# EAGLE design STK-681-332-E EvalBoard OwnRoutingStarted V4.2 (EAGLE 9.3.1)

## Sheet 1 of 3: Supply, Reverse Voltage Protection, Power Indicators
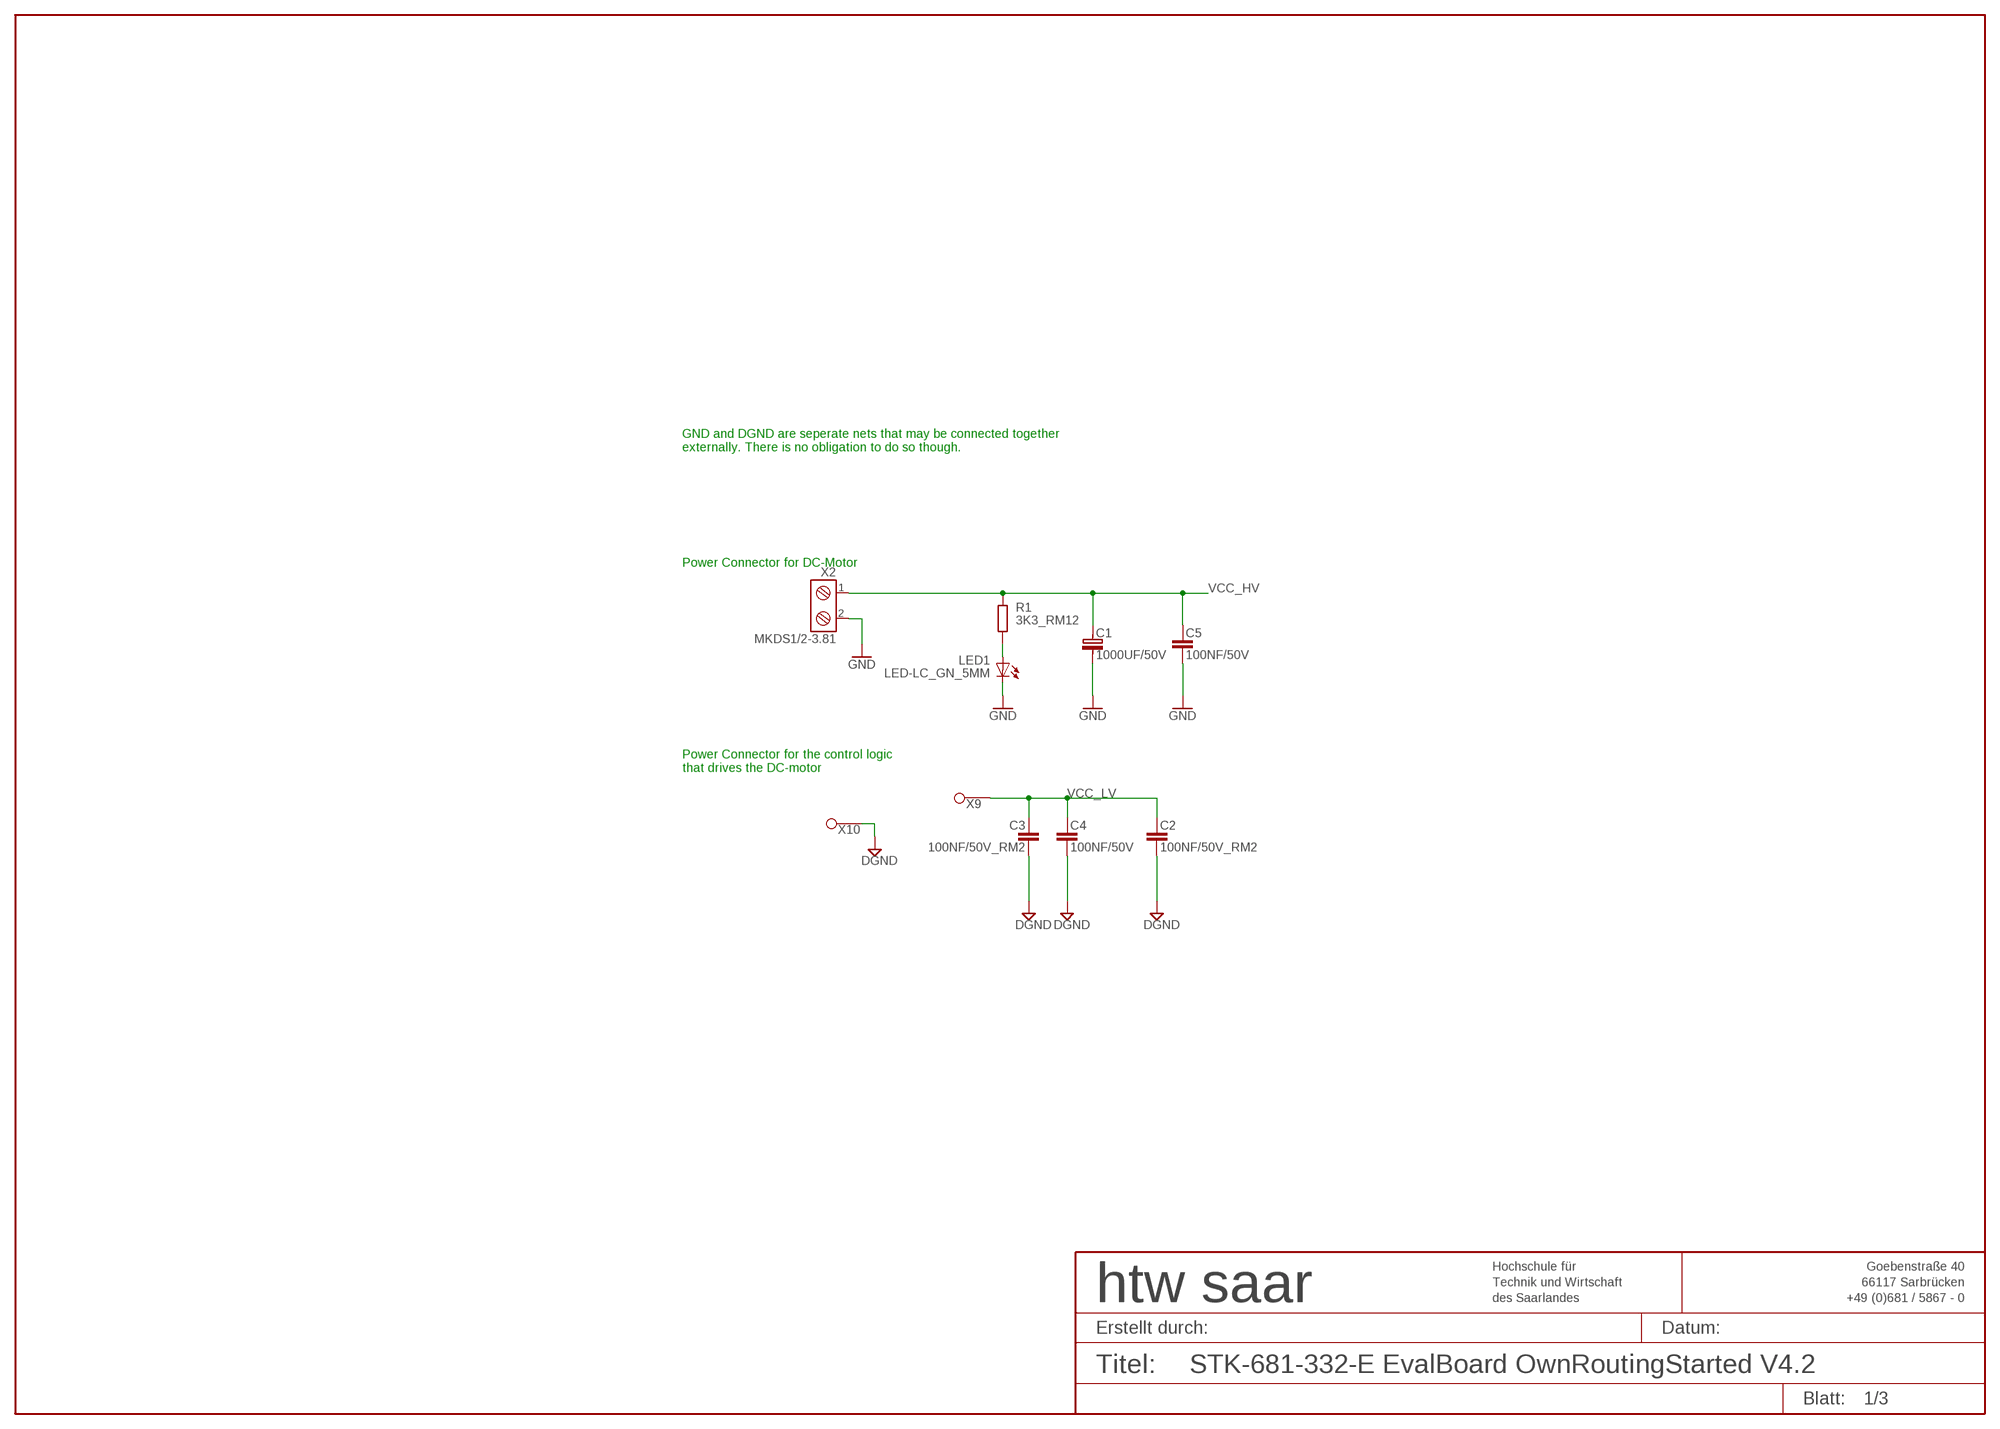
[diagram p0: schematic, sheet 1]

### Parts
C1  1000UF/50V  [RM7,5D16]
C2  100NF/50V_RM2  [RM2.54]
C3  100NF/50V_RM2  [RM2.54]
C4  100NF/50V  [0603]
C5  100NF/50V  [1206]
LED1  LED-LC_GN_5MM  [LED5MM]
R1  3K3_RM12  [RM12.7]
X2  MKDS1/2-3.81  [MKDS1/2-3.81]
X9  ST_1X1  [ST_1X1]
X10  ST_1X1  [ST_1X1]

### Nets
GND [GND]: C1.- C2.2 C3.2 C4.2 C5.2 LED1.K(C) X2.2 X10.1 ; supply symbol labelled DGND ; also sheet 2,3
N$5 [U5V]: LED1.A R1.1
VCC_HV [U24V]: C1.+ C5.1 R1.2 X2.1 ; also sheet 3
VCC_LV [U5V]: C2.1 C3.1 C4.1 X9.1 ; also sheet 2,3

### Notes on the sheet
- GND and DGND are seperate nets that may be connected together  
  externally. There is no obligation to do so though.
- Power Connector for DC-Motor
- Power Connector for the control logic
  that drives the DC-motor

## Sheet 2 of 3: Direction Signal Decoding, Brake, Disable & PWM
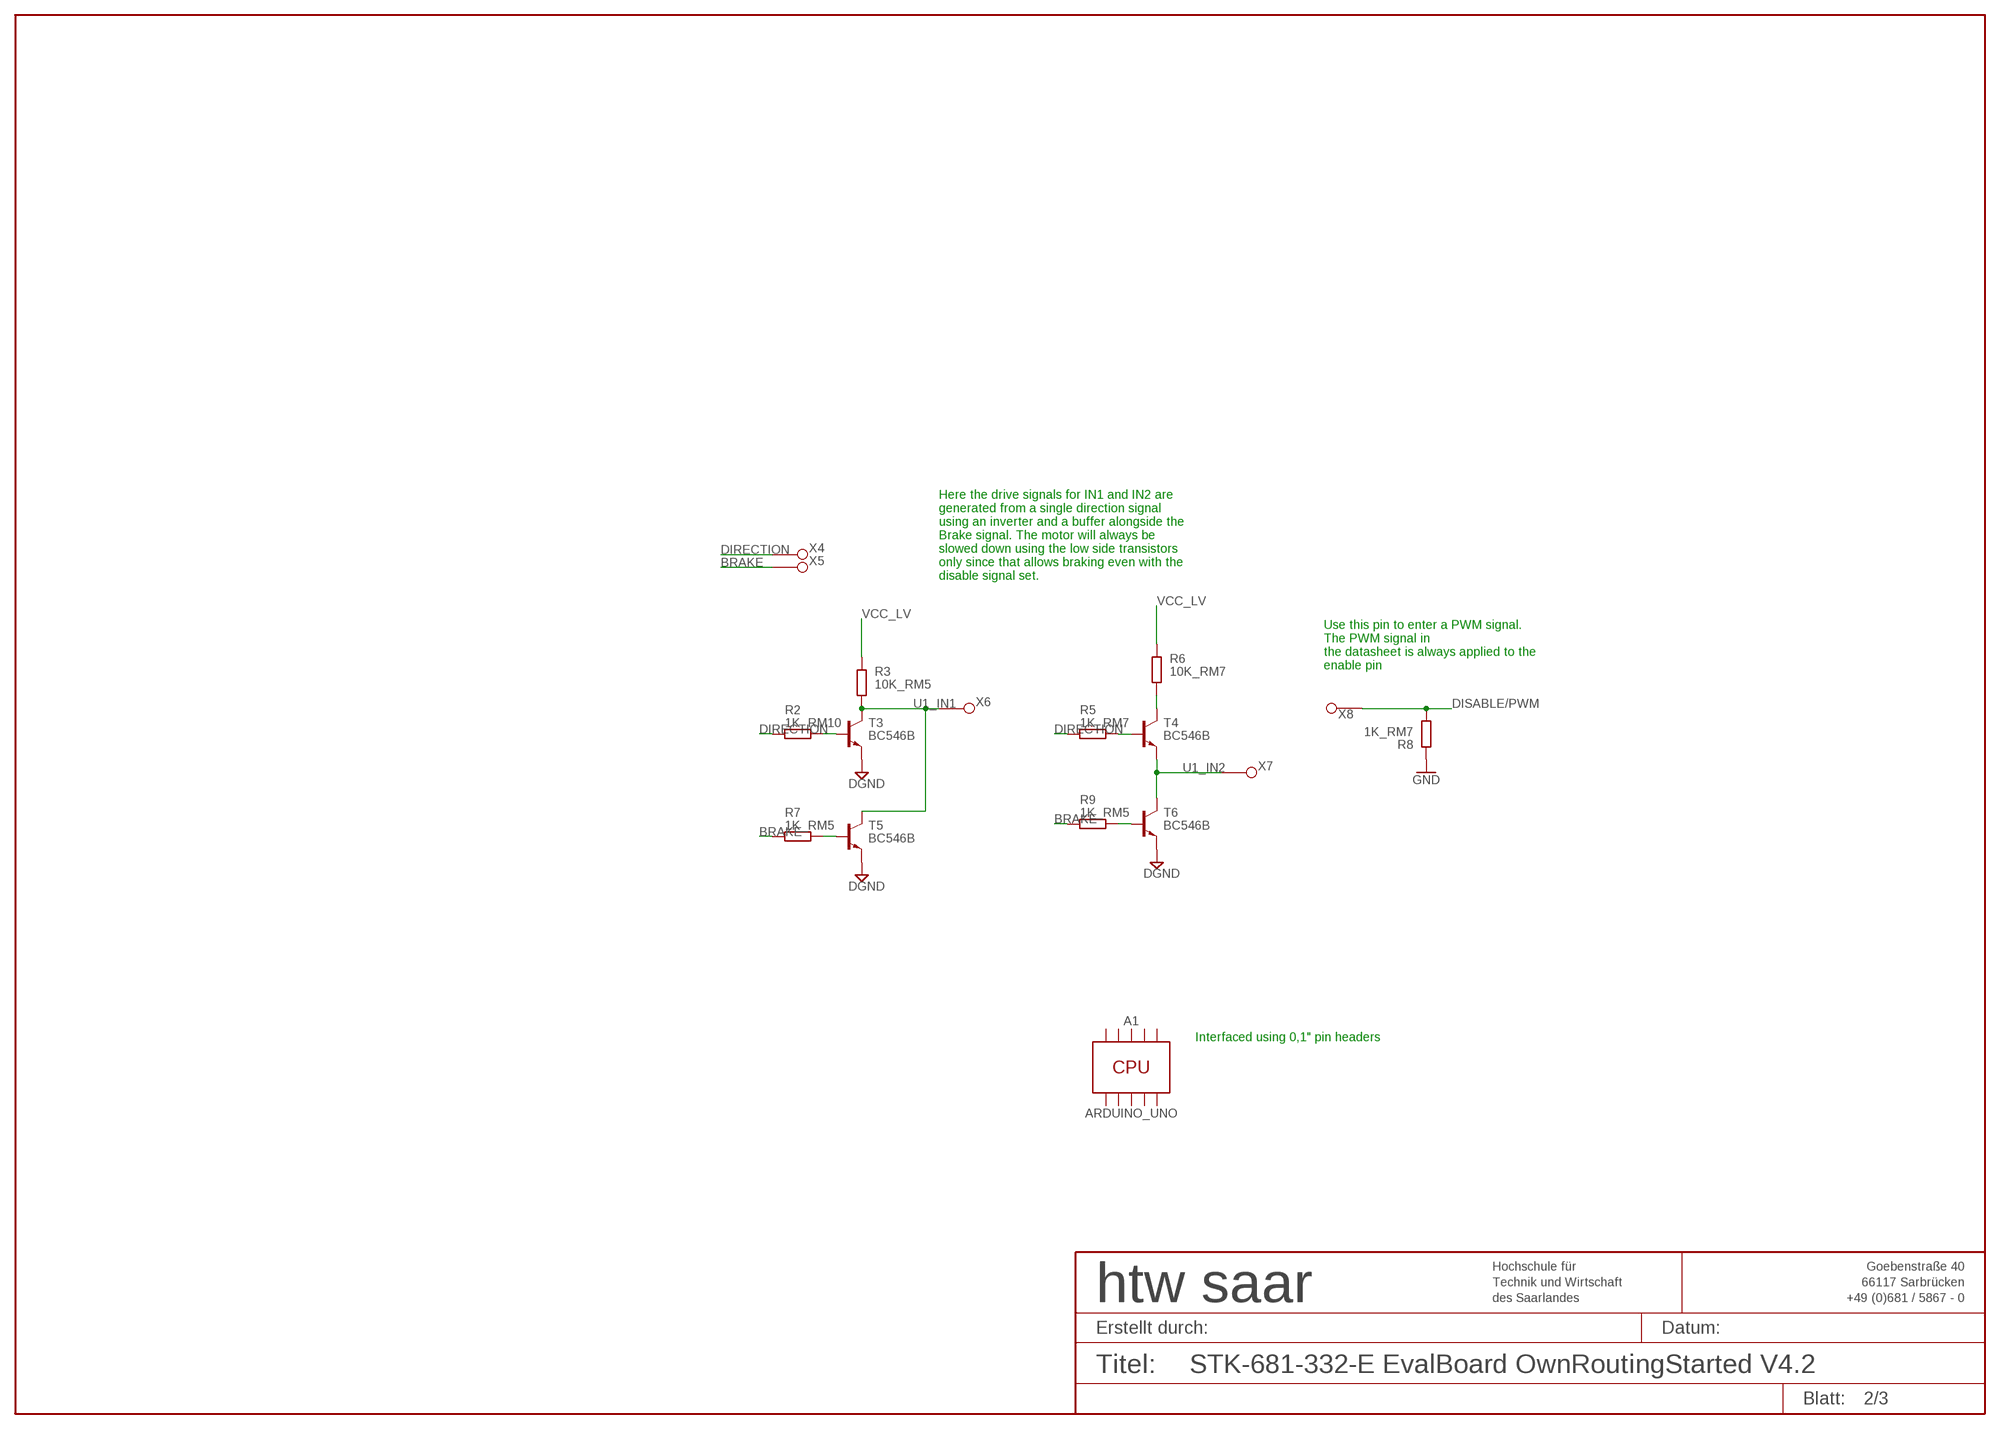
[diagram p1: schematic, sheet 2]

### Parts
A1  ARDUINO_UNO  [ARDUINO_UNO]
R2  1K_RM10  [RM10.16]
R3  10K_RM5  [RM5.08]
R5  1K_RM7  [RM7.62]
R6  10K_RM7  [RM7.62]
R7  1K_RM5  [RM5.08]
R8  1K_RM7  [RM7.62]
R9  1K_RM5  [RM5.08]
T3  BC546B  [TO92]
T4  BC546B  [TO92]
T5  BC546B  [TO92]
T6  BC546B  [TO92]
X4  DIRECTION  ST_1X1  [ST_1X1]
X5  BRAKE  ST_1X1  [ST_1X1]
X6  U1_IN1  ST_1X1  [ST_1X1]
X7  U1_IN2  ST_1X1  [ST_1X1]
X8  DISABLE_&_PWM  ST_1X1  [ST_1X1]

### Nets
BRAKE [U5V]: R7.1 R9.1 X5.1
DIRECTION [U5V]: R2.1 R5.1 X4.1
DISABLE/PWM [U5V]: R8.1 X8.1 ; also sheet 3
GND [GND]: R8.2 T3.3(E) T5.3(E) T6.3(E) ; supply symbol labelled DGND ; also sheet 1,3
N$3 [U5V]: R2.2 T3.2(B)
N$4 [U5V]: R5.2 T4.2(B)
N$6 [U5V]: R6.1 T4.1(C)
N$8 [U5V]: R7.2 T5.2(B)
N$9 [U5V]: R9.2 T6.2(B)
U1_IN1 [U5V]: R3.1 T3.1(C) T5.1(C) X6.1 ; also sheet 3
U1_IN2 [U5V]: T4.3(E) T6.1(C) X7.1 ; also sheet 3
VCC_LV [U5V]: R3.2 R6.2 ; also sheet 1,3

### Notes on the sheet
- Here the drive signals for IN1 and IN2 are
  generated from a single direction signal 
  using an inverter and a buffer alongside the 
  Brake signal. The motor will always be
  slowed down using the low side transistors
  only since that allows braking even with the
  disable signal set.
- Use this pin to enter a PWM signal.
  The PWM signal in
  the datasheet is always applied to the 
  enable pin
- Interfaced using 0,1" pin headers

## Sheet 3 of 3: Hook up of the actual IC itself
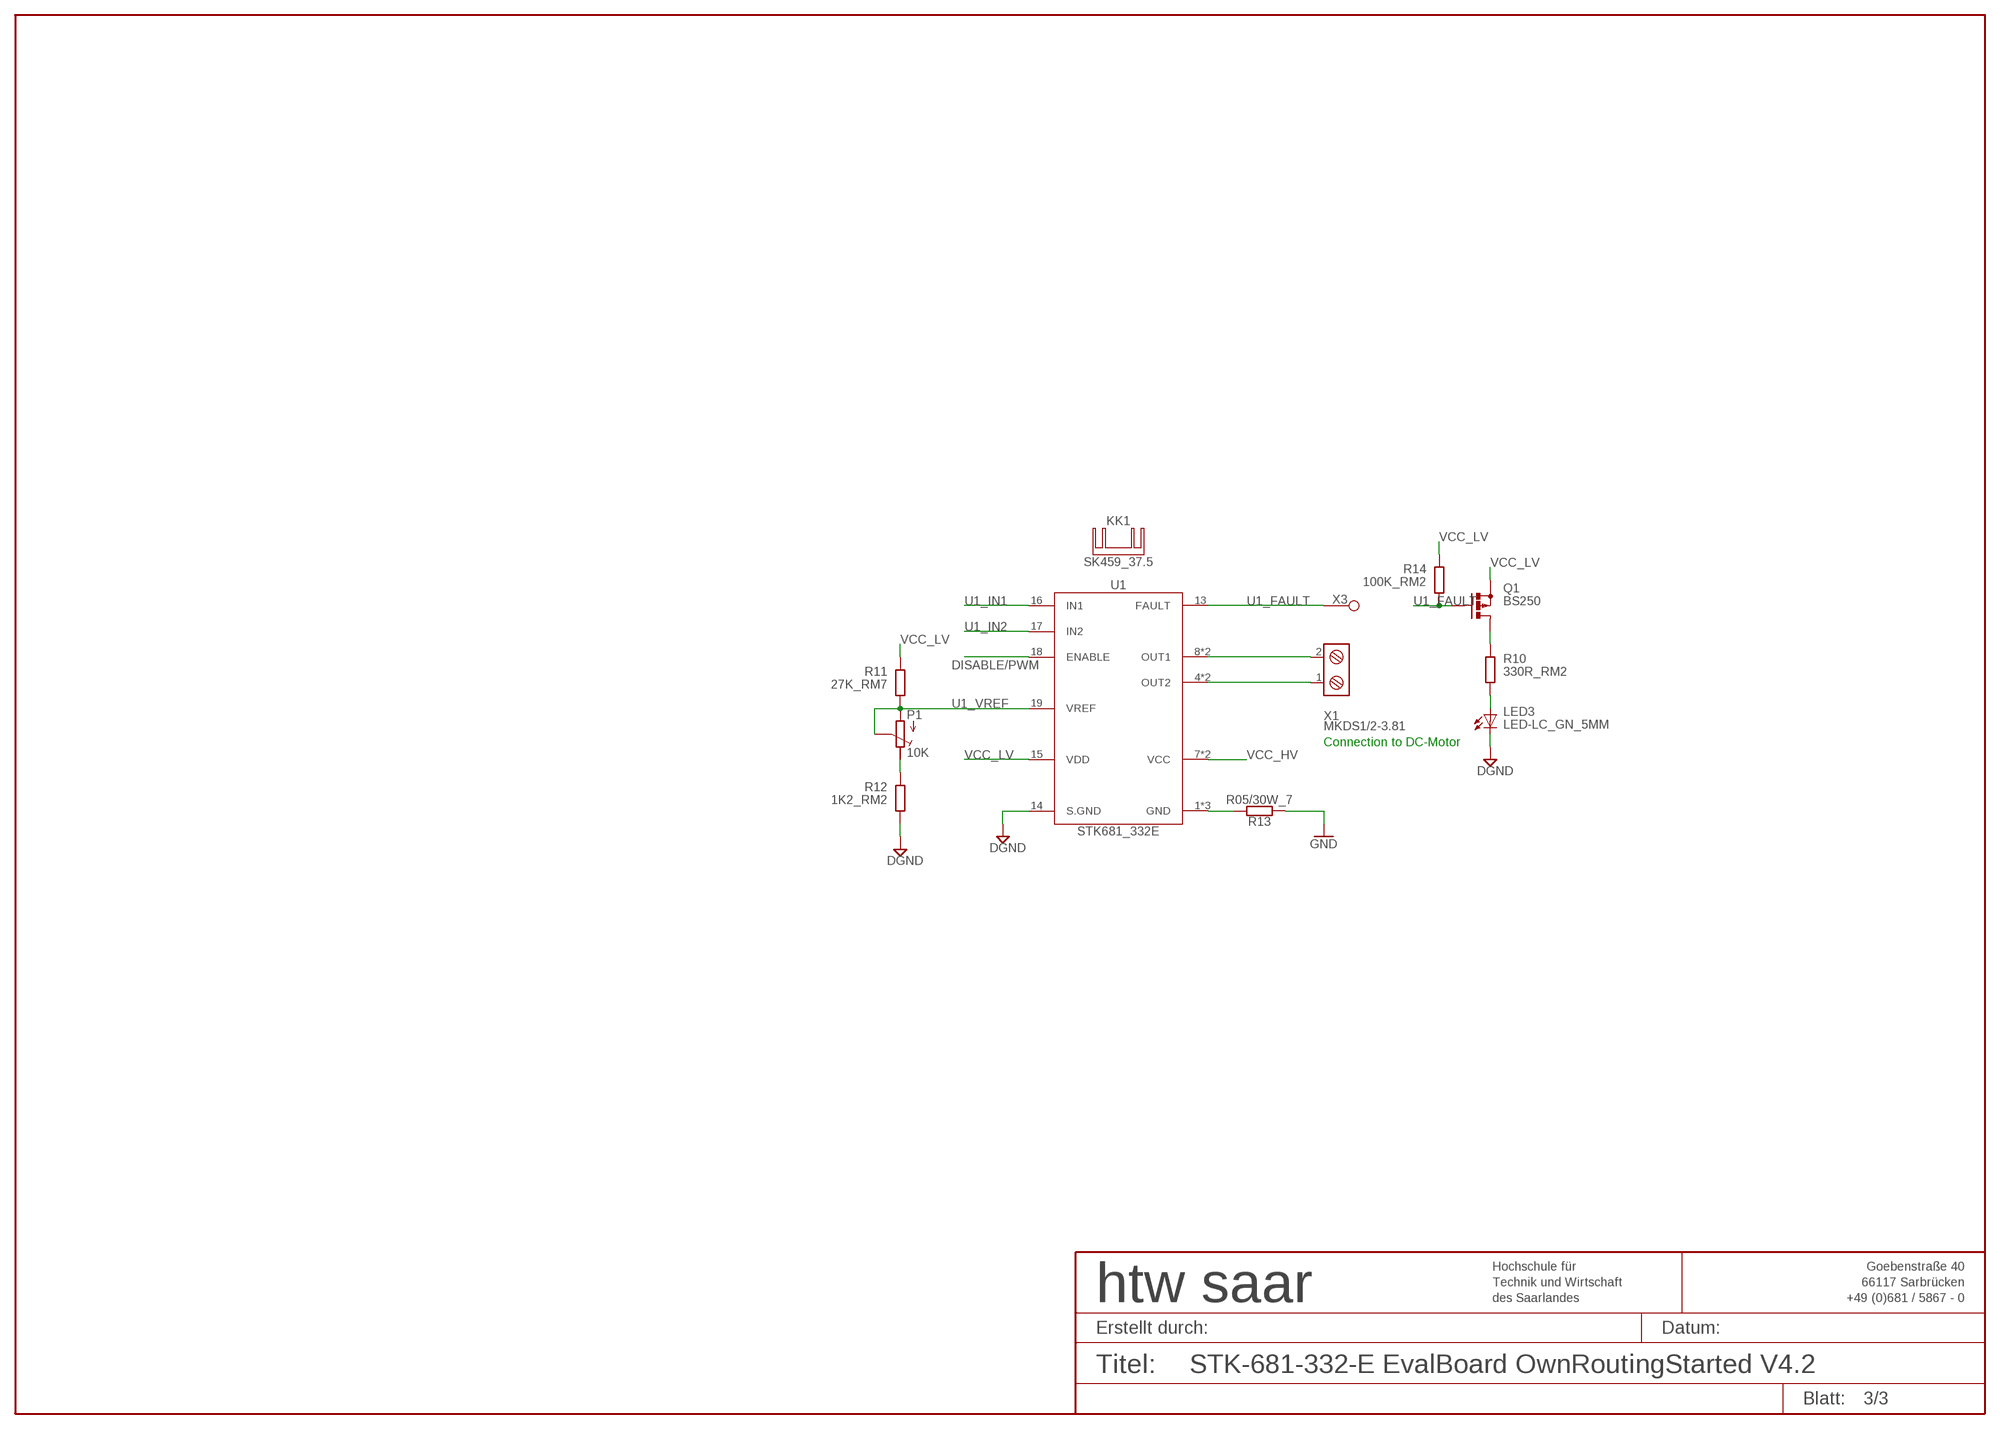
[diagram p2: schematic, sheet 3]

### Parts
KK1  SK459_37.5  [SK459]
LED3  LED-LC_GN_5MM  [LED5MM]
P1  10K  [R_TRIMM]
Q1  BS250  [SOT54E]
R10  330R_RM2  [RM2.54]
R11  27K_RM7  [RM7.62]
R12  1K2_RM2  [RM2.54]
R13  R05/30W_7  [TO220V/2_7]
R14  100K_RM2  [RM2.54]
U1  STK681_332E  [SIP19]
X1  MKDS1/2-3.81  [MKDS1/2-3.81]
X3  ST_1X1  [ST_1X1]

### Nets
DISABLE/PWM [U5V]: U1.18(ENABLE) ; also sheet 2
GND [GND]: LED3.K(C) R12.1 R13.1 U1.14(S.GND) ; supply symbol labelled DGND ; also sheet 1,2
N$1 [U24V]: U1.4(OUT2) U1.6(OUT2) X1.1
N$2 [U24V]: U1.8(OUT1) U1.10(OUT1) X1.2
N$10 [U5V]: LED3.A R10.1
N$11 [U5V]: Q1.D R10.2
N$12 [U5V]: P1.3(E) R12.2
SENSE [U5V]: R13.2 U1.1(GND) U1.2(GND) U1.3(GND)
U1_FAULT [U5V]: Q1.G R14.1 U1.13(FAULT) X3.1
U1_IN1 [U5V]: U1.16(IN1) ; also sheet 2
U1_IN2 [U5V]: U1.17(IN2) ; also sheet 2
U1_VREF [U5V]: P1.1(A) P1.2(S) R11.1 U1.19(VREF)
VCC_HV [U24V]: U1.7(VCC) U1.9(VCC) ; also sheet 1
VCC_LV [U5V]: Q1.S R11.2 R14.2 U1.15(VDD) ; also sheet 1,2
Unconnected: U1.5(NC) U1.11(NC) U1.12(NC)

### Notes on the sheet
- Connection to DC-Motor

## Library data of the parts
A1 = Boards:ARDUINO_UNO: Arduino Uno (Evaluation-Board mit ATmega328P); CONRAD: 1275279 - 05; EXP-TECH: EXP-R08-002; ID: EBG-EVA-0001; REICHELT: ARDUINO UNO DIP; TYPE: ASSEMBLY
C1 = ELKO_THD:1000UF/50V: 1000µF/50V LowESR-Elko, THD; ID: EKO-ELT-0003; REICHELT: RAD FR 1.000/50; TYPE: THD
C2 C3 = Kondensator_Keramik_THD:100NF/50V: 100nF/50V X7R-Kondensator, THD; ID: EKO-KET-0001; REICHELT: X7R-2,5 100N; TYPE: THD
C4 = Kondensator_0603:100NF/50V: 100nF/50V X7R-Kondensator, SMD 0603; CONRAD: 445544 - 05; ID: EKO-S06-0001; TYPE: SMD
C5 = Kondensator_1206:100NF/50V: 100nF/50V X7R-Kondensator, SMD 1206; ID: EKO-S12-0001; REICHELT: X7R-G1206 100N; TYPE: SMD
KK1 = Mechanisch:SK459: SK459 (Kühlkörper); ID: EGK-KKR-0005; POLLIN: 430003; TYPE: THD
LED1 LED3 = Optisch:LED-LC_GN: Low-current-LED grün; ID: EOP-LED-0001; REICHELT: LED 5MM 2MA GN; TYPE: THD
P1 = Widerstand_var:10K: 10kΩ Trimmer; ID: EWI-POT-0001; REICHELT: 64W-10K; TYPE: THD
Q1 = transistor-small-signal:BS250: P-CHANNEL MOS FET
R1 = Widerstand_0207:3K3: 3,3kΩ Widerstand, THD 0207; ID: EWI-THD-3301; REICHELT: METALL 3,30K; TYPE: THD
R2 R5 R7-R9 = Widerstand_0207:1K: 1kΩ Widerstand, THD 0207; ID: EWI-THD-1001; REICHELT: METALL 1,00K; TYPE: THD
R3 R6 = Widerstand_0207:10K: 10kΩ Widerstand, THD 0207; ID: EWI-THD-1002; REICHELT: METALL 10,0K; TYPE: THD
R10 = Widerstand_0207:330R: 330Ω Widerstand, THD 0207; ID: EWI-THD-3300; REICHELT: METALL 330; TYPE: THD
R11 = Widerstand_0207:27K: 27kΩ Widerstand, THD 0207; ID: EWI-THD-2702; REICHELT: METALL 27,0K; TYPE: THD
R12 = Widerstand_0207:1K2: 1,2kΩ Widerstand, THD 0207; ID: EWI-THD-1201; REICHELT: METALL 1,20K; TYPE: THD
R13 = Widerstand_sonstige:R05/30W: 0,05Ω 30W Widerstand, TO-220; FARNELL: 2328295; ID: EWI-PWR-0001; TYPE: THD
R14 = Widerstand_0207:100K: 100kΩ Widerstand, THD 0207; ID: EWI-THD-1003; REICHELT: METALL 100K; TYPE: THD
T3-T6 = Transistor:BC546B: BC546 (NPN-Transistor); ID: EHL-TRA-0001; REICHELT: BC 546B; TYPE: THD
U1 = Analog:STK681_332E: STK681-332-E (DC Motor Driver); FARNELL: 2217062; ID: EIC-ANA-0014; MOUSER: 863-STK681-332-E; TYPE: THD
X1 X2 = Klemmen:MKDS1/2-3.81: Schraubklemme 2-fach, Liftsystem RM 3,81; FARNELL: 3704579; ID: EKL-PCB-0001; TYPE: THD
X3-X10 = Stecker:ST_1X1: Stiftleiste 1x1; CONRAD: 737450 - 05 (Stange); ID: EST-PCB-0001; TYPE: THD

## Net classes
0 DEF: width 0.2 mm, drill 0.2 mm, clearance 0.2 mm
1 +UZK: width 0.2 mm, drill 0.2 mm, clearance 2 mm to class 0, clearance 2 mm
2 -UZK: width 0.2 mm, drill 0.2 mm, clearance 0.2 mm to class 0, clearance 2 mm to class 1, clearance 0.2 mm
3 HV: width 0.2 mm, drill 0.2 mm, clearance 2.5 mm to class 0, clearance 2.5 mm to class 1, clearance 2.5 mm to class 2, clearance 2.5 mm
4 HS_SUP: width 0.2 mm, drill 0.2 mm, clearance 2 mm to class 0, clearance 0.3 mm to class 1, clearance 0.6 mm to class 2, clearance 2.5 mm to class 3, clearance 0.2 mm
5 HS_SW: width 0.2 mm, drill 0.2 mm, clearance 2 mm to class 0, clearance 0.7 mm to class 1, clearance 2 mm to class 2, clearance 2.5 mm to class 3, clearance 0.3 mm to class 4, clearance 0.5 mm
6 LS_SW: width 0.2 mm, drill 0.2 mm, clearance 2 mm to class 0, clearance 0.7 mm to class 1, clearance 0.7 mm to class 2, clearance 2.5 mm to class 3, clearance 0.3 mm to class 4, clearance 2 mm to class 5, clearance 0.5 mm
7 Motor: width 0.2 mm, drill 0.2 mm, clearance 2.5 mm to class 0, clearance 2.5 mm to class 1, clearance 2.5 mm to class 2, clearance 2.5 mm to class 3, clearance 2.5 mm to class 4, clearance 2.5 mm to class 5, clearance 2.5 mm to class 6, clearance 0.5 mm
8 SEK: width 0.2 mm, drill 0.2 mm, clearance 1 mm to class 0, clearance 6.84 mm to class 1, clearance 6.84 mm to class 2, clearance 6.84 mm to class 3, clearance 6.84 mm to class 4, clearance 6.84 mm to class 5, clearance 6.84 mm to class 6, clearance 6.84 mm to class 7, clearance 1 mm
9 U85V: width 0.2 mm, drill 0.2 mm, clearance 0.7 mm to class 0, clearance 6.84 mm to class 1, clearance 6.84 mm to class 2, clearance 6.84 mm to class 3, clearance 6.84 mm to class 4, clearance 6.84 mm to class 5, clearance 6.84 mm to class 6, clearance 6.84 mm to class 7, clearance 1 mm to class 8, clearance 0.7 mm
10 U24V: width 0.2 mm, drill 0.2 mm, clearance 0.3 mm to class 0, clearance 6.84 mm to class 1, clearance 6.84 mm to class 2, clearance 6.84 mm to class 3, clearance 6.84 mm to class 4, clearance 6.84 mm to class 5, clearance 6.84 mm to class 6, clearance 6.84 mm to class 7, clearance 1 mm to class 8, clearance 0.7 mm to class 9, clearance 0.3 mm
11 U5V: width 0.2 mm, drill 0.2 mm, clearance 0.2 mm to class 0, clearance 6.84 mm to class 1, clearance 6.84 mm to class 2, clearance 6.84 mm to class 3, clearance 6.84 mm to class 4, clearance 6.84 mm to class 5, clearance 6.84 mm to class 6, clearance 6.84 mm to class 7, clearance 1 mm to class 8, clearance 0.7 mm to class 9, clearance 0.3 mm to class 10, clearance 0.2 mm
12 GND: width 0.2 mm, drill 0.2 mm, clearance 0.2 mm to class 0, clearance 3.42 mm to class 1, clearance 3.42 mm to class 2, clearance 3.42 mm to class 3, clearance 3.42 mm to class 4, clearance 3.42 mm to class 5, clearance 3.42 mm to class 6, clearance 3.42 mm to class 7, clearance 1 mm to class 8, clearance 0.7 mm to class 9, clearance 0.3 mm to class 10, clearance 0.2 mm to class 11, clearance 0.2 mm
13 MISC: width 0.2 mm, drill 0.2 mm, clearance 0.2 mm to class 0, clearance 6.84 mm to class 1, clearance 6.84 mm to class 2, clearance 6.84 mm to class 3, clearance 6.84 mm to class 4, clearance 6.84 mm to class 5, clearance 6.84 mm to class 6, clearance 6.84 mm to class 7, clearance 2 mm to class 8, clearance 2 mm to class 9, clearance 2 mm to class 10, clearance 2 mm to class 11, clearance 2 mm to class 12, clearance 0.2 mm

## Board
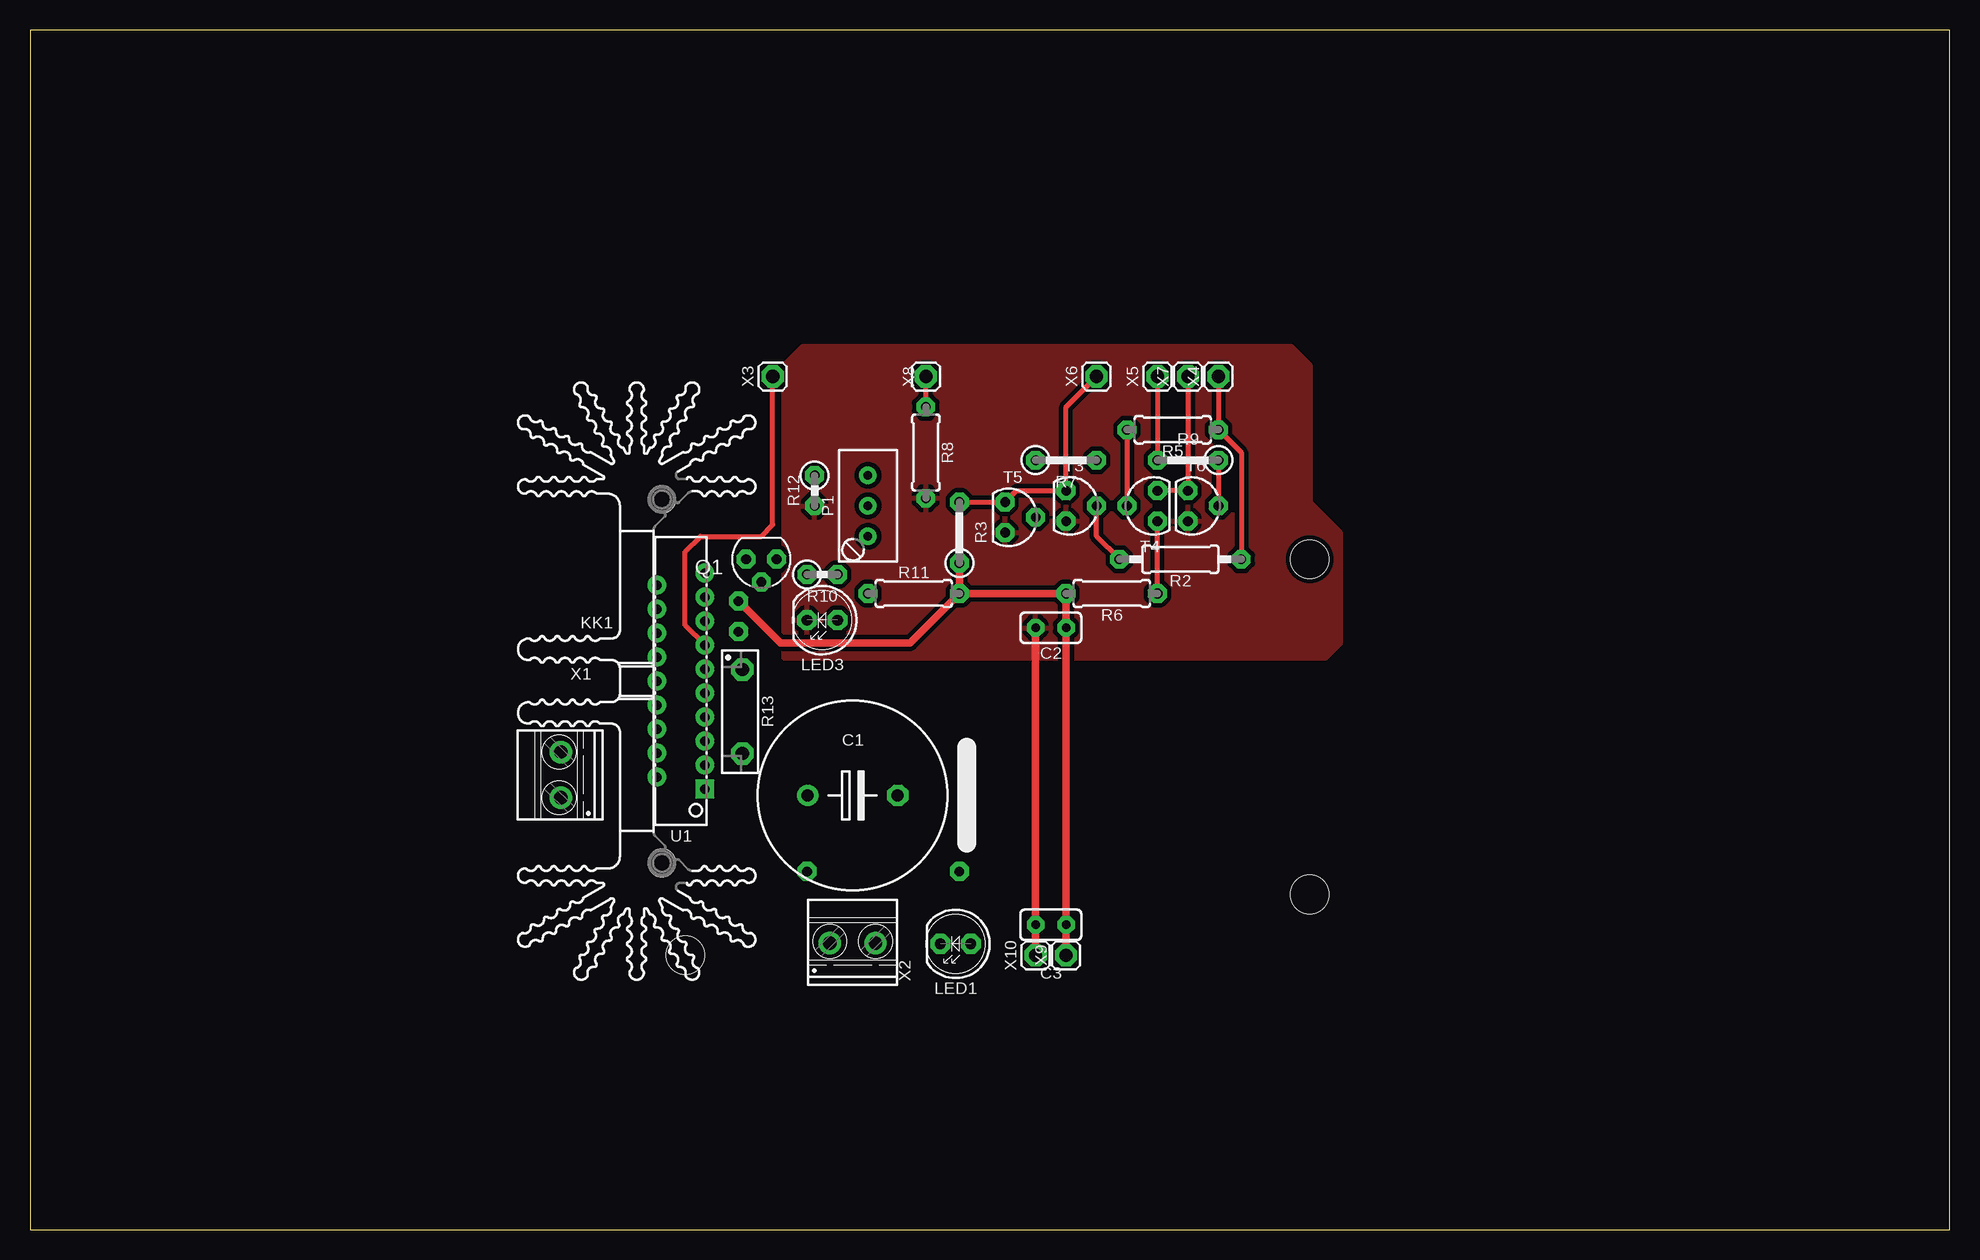
[diagram p3: board, top side]
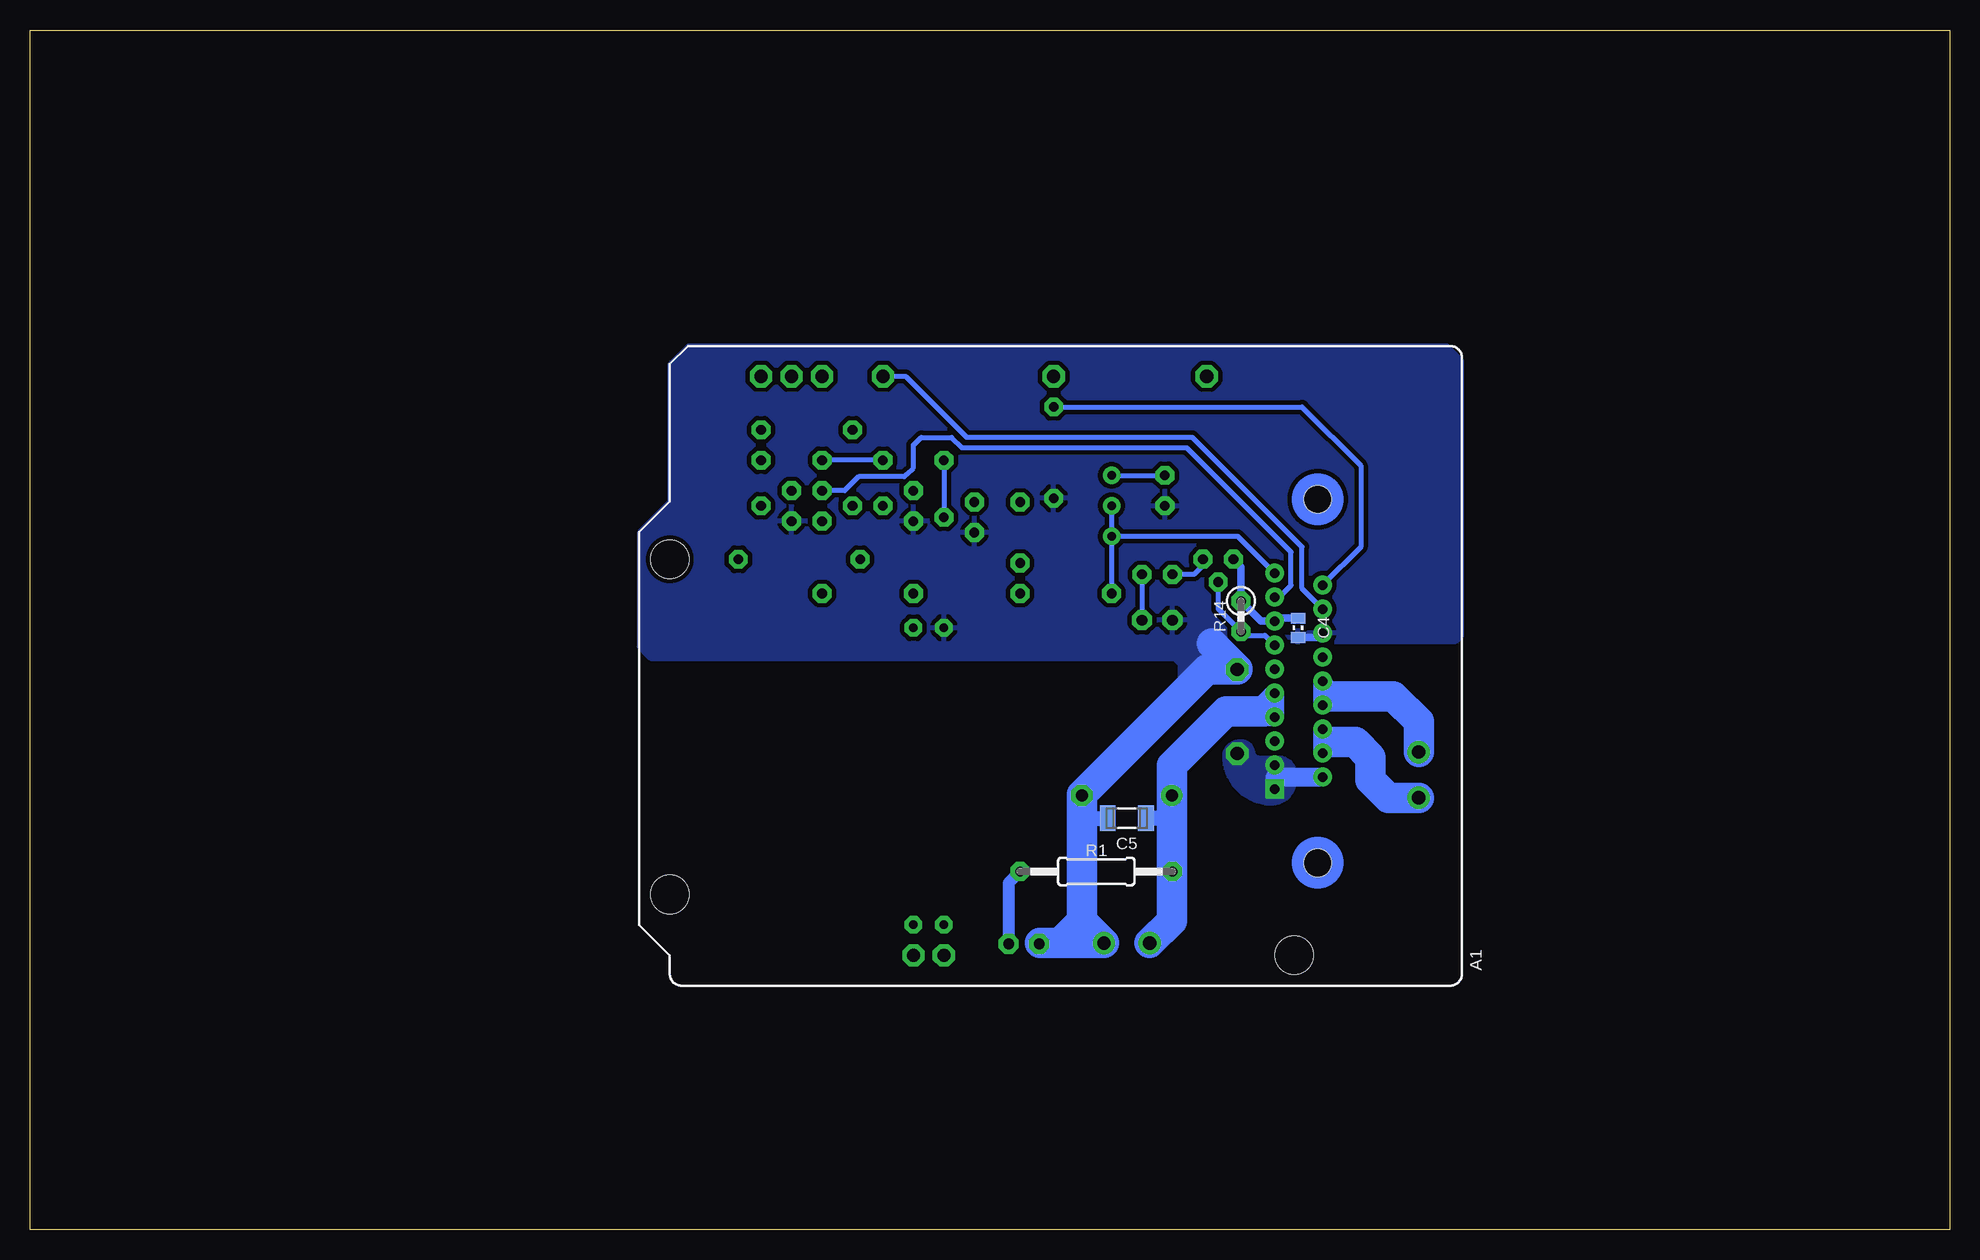
[diagram p4: board, bottom side, seen from below]

Size 160 x 100 mm. Coordinates in mm from the lower left corner, seen from the top.
Outline: 0,0 160,0 160,100 0,100 0,0
Copper layers (1*16): Top 0.035mm / dielectric 1.5mm / Bottom 0.035mm
Design rules "2LayersINT": minimum track width 0.3mm, minimum drill 0.6mm, track to track 15mil, track to pad 15mil, pad to pad 15mil, via to via 15mil, smd to smd 15mil, copper to edge 15mil, drill to drill 0.5mm, minimum pad ring 15mil, minimum via ring 15mil, stop-mask expansion 0mil, vias tented up to drill 100mm, thermal gap 15mil

### Footprints (pad centres in the part's own frame; a part is rotated, then mirrored left to right if it is on the bottom)
ARDUINO_UNO = hole 3.2: -13.97,2.54; -66.04,7.62; -66.04,35.56
RM7,5D16 = drill 1 pad 1.65: + -3.75,0 | drill 1 pad 1.65 octagon: - 3.75,0
RM2.54 = drill 0.7 pad 1.3 octagon: 1 -1.27,0; 2 1.27,0
0603 = smd 0.9 x 1.2: 1 -0.8,0; 2 0.8,0
1206 = smd 1.3 x 2.1: 1 -1.6,0; 2 1.6,0
SK459 = hole 2.3: -15.15,0.6; 15.15,0.6
LED5MM = drill 0.9 pad 1.5 octagon: A -1.27,0; K 1.27,0
R_TRIMM = drill 0.7 pad 1.3: 1 -2.54,0; 2 0,0; 3 2.54,0
SOT54E = drill 0.813 octagon: D -1.27,0; G 0,1.905; S 1.27,0
RM12.7 = drill 0.8 pad 1.4 octagon: 1 -6.35,0; 2 6.35,0
RM10.16 = drill 0.8 pad 1.4 octagon: 1 -5.08,0; 2 5.08,0
RM5.08 = drill 0.8 pad 1.4 octagon: 1 -2.54,0; 2 2.54,0
RM7.62 = drill 0.8 pad 1.4 octagon: 1 -3.81,0; 2 3.81,0
RM2.54' = drill 0.8 pad 1.4 octagon: 1 -1.27,0; 2 1.27,0
TO220V/2_7 = drill 1.1 pad 1.8 octagon: 1 -3.5,0; 2 3.5,0
TO92 = drill 0.8 pad 1.4 octagon: 1 0,1.27; 2 2.54,0; 3 0,-1.27
SIP19 = drill 0.8 pad 1.4 square: 1 -9,-2 | drill 0.8 pad 1.4: 2 -8,2; 3 -7,-2; 4 -6,2; 5 -5,-2; 6 -4,2; 7 -3,-2; 8 -2,2; 9 -1,-2; 10 0,2; 11 1,-2; 12 2,2; 13 3,-2; 14 4,2; 15 5,-2; 16 6,2; 17 7,-2; 18 8,2; 19 9,-2
MKDS1/2-3.81 = drill 1.1 pad 1.8: 1 -1.905,0; 2 1.905,0
ST_1X1 = drill 1.1 pad 1.8 octagon: 1 0,0

### Placement (x,y rotation side)
A1  40.64,20.32 0 bottom
C1  68.58,36.2 0 top
C2  85.09,50.16 180 top
C3  85.09,25.4 180 top
C4  54.29,50.16 270 bottom
C5  68.58,34.29 180 bottom
KK1  52.07,45.72 270 top
LED1  77.15,23.81 180 top
LED3  66.04,50.8 180 top
P1  69.85,60.33 90 top
Q1  60.96,55.88 180 top
R1  71.12,29.84 0 bottom
R2  95.89,55.88 180 top
R3  77.47,58.1 270 top
R5  95.25,66.67 180 top
R6  90.17,53.02 180 top
R7  86.36,64.14 180 top
R8  74.68,64.77 270 top
R9  96.52,64.14 0 top
R10  330R_RM2  [RM2.54']  66.04,54.61 180 top
R11  73.66,53.02 0 top
R12  1K2_RM2  [RM2.54']  65.41,61.59 90 top
R13  59.37,43.18 270 top
R14  100K_RM2  [RM2.54']  59.05,51.12 90 bottom
T3  86.36,60.33 0 top
T4  93.98,60.33 180 top
T5  81.28,59.37 0 top
T6  96.52,60.33 0 top
U1  54.25,45.72 90 top
X1  44.25,37.9 90 top
X2  68.58,23.88 0 top
X3  61.91,71.12 0 top
X4  99.06,71.12 0 top
X5  93.98,71.12 0 top
X6  88.9,71.12 0 top
X7  96.52,71.12 0 top
X8  74.68,71.12 0 top
X9  86.36,22.86 0 top
X10  83.82,22.86 0 top

### Tracks (layer width: path | path; a pad name or v marks a point on that pad's centre or on a via)
BRAKE
  Top 0.406: X5.1 R9.1
  Bottom 0.406: R7.1 R9.1
DIRECTION
  Top 0.406: X4.1 R5.1 100.97,64.77 R2.1
DISABLE/PWM
  Top 0.406: R8.1 X8.1
  Bottom 0.406: U1.18 49.08,56.9 49.08,63.68 53.98,68.58 R8.1
GND
  Top 0.61: C2.2 C3.2 X10.1
  Bottom 0.406: C1.- 72.33,36.26
  Bottom 0.61: U1.14 52.61,49.37 C4.2
  Bottom 1.016: 75.82,23.88 LED1.K
  Bottom 1.27: C1.- 72.39,36.2 72.39,34.29 C5.2
  Bottom 2.54: 72.33,25.72 X2.2 73.66,23.88 | 72.33,25.72 C1.- | 72.33,36.26 61.91,46.68 R13.1 59.37,46.73 61.49,48.84 | 73.66,23.88 75.82,23.88 | 72.33,25.72 73.66,24.39 73.66,23.88
  pour Bottom (isolate 0.2): 40.64,72.39 41.91,73.66 105.09,73.66 106.68,72.07 106.68,60.64 109.22,58.1 109.22,48.58 108.27,47.62 64.61,47.62 64.14,47.15 64.14,45.72 62.23,45.72 60.03,49.02 41.15,49.02 40.64,49.53
  pour Top (isolate 0.2): 64.45,73.66 105.09,73.66 106.68,72.07 106.68,60.64 109.22,58.1 109.22,48.9 107.95,47.62 62.87,47.62 62.86,72.07
N$1
  Bottom 1.27: U1.4 51.44,40.54 51.44,40.64
  Bottom 1.6: U1.6 U1.4
  Bottom 2.54: X1.1 46.79,35.99 48.26,37.47 48.26,39.37 49.53,40.64 51.44,40.64
N$2
  Bottom 1.27: U1.10 51.62,45.09 50.8,45.09 51.44,44.45
  Bottom 1.6: U1.10 U1.8
  Bottom 2.54: X1.2 44.25,42.34 46.35,44.45 50.8,44.45 51.44,44.45
N$3
  Top 0.406: R2.2 88.9,57.78 T3.2
N$4
  Top 0.406: R5.2 T4.2
N$5
  Bottom 1.016: R1.1 78.42,28.89 LED1.A
N$6
  Top 0.406: R6.1 T4.1
N$8
  Bottom 0.406: R7.2 T5.2
N$9
  Top 0.406: R9.2 T6.2
N$10
  Bottom 0.406: R10.1 LED3.A
N$11
  Bottom 0.406: Q1.D 62.23,55.35 62.97,54.61 R10.2
N$12
  Bottom 0.406: P1.3 R12.2
SENSE
  Bottom 1.6: 56.21,37.72 U1.2
  pour Bottom (isolate 0.2, no thermals): 55.88,39.29 57.39,39.29 arc90 58.1,39.85 arc-90 59.05,40.64 arc-90 60.44,39.49 arc-90 56.52,35.56 arc-90 54.61,37.47 54.61,38.02 arc-90
U1_FAULT
  Top 0.406: X3.1 61.91,58.74 60.96,57.78 55.88,57.78 54.61,56.52 54.61,50.36 U1.13
  Bottom 0.406: Q1.G 60.96,51.75 R14.1 58.74,49.53 57.06,49.53 U1.13
U1_IN1
  Top 0.406: R3.1 T5.1 82.23,61.59 T3.1 86.36,68.58 X6.1
  Bottom 0.406: U1.16 53.98,53.44 53.98,56.9 63.11,66.04 81.92,66.04 87,71.12 X6.1
U1_IN2
  Top 0.406: T4.3 T6.1 X7.1
  Bottom 0.406: T4.3 92.1,61.59 90.93,62.77 87.12,62.77 86.92,62.96 86.9,62.96 86.36,63.5 86.36,65.41 85.72,66.04 83.19,66.04 82.33,65.18 63.59,65.18 54.89,56.48 54.89,53.7 55.87,52.72 U1.17
U1_VREF
  Bottom 0.406: U1.19 59.32,57.78 P1.1 | P1.1 R11.1 | P1.2 P1.1
VCC_HV
  Bottom 1.016: R1.2 64.83,29.84
  Bottom 1.27: C1.+ 64.77,36.2 64.77,34.29 C5.1
  Bottom 1.6: 57.15,43.18 57.15,42.72 U1.7 U1.9 57.79,43.18 59.05,43.18
  Bottom 2.54: X2.1 64.83,25.72 64.83,29.84 C1.+ 64.83,38.67 60.33,43.18 59.05,43.18 57.15,43.18
VCC_LV
  Top 0.61: X9.1 C3.1 C2.1 R6.2 R11.2 | R11.2 73.34,48.9 62.55,48.9 R14.2 | R11.2 R3.2
  Bottom 0.61: Q1.S 59.05,55.24 R14.2 57.39,50.72 U1.15 56.01,50.97 C4.1